# Altium schematic sheet Sheet1.SchDoc
size A4; SheetNumber: 1; SheetTotal: 6
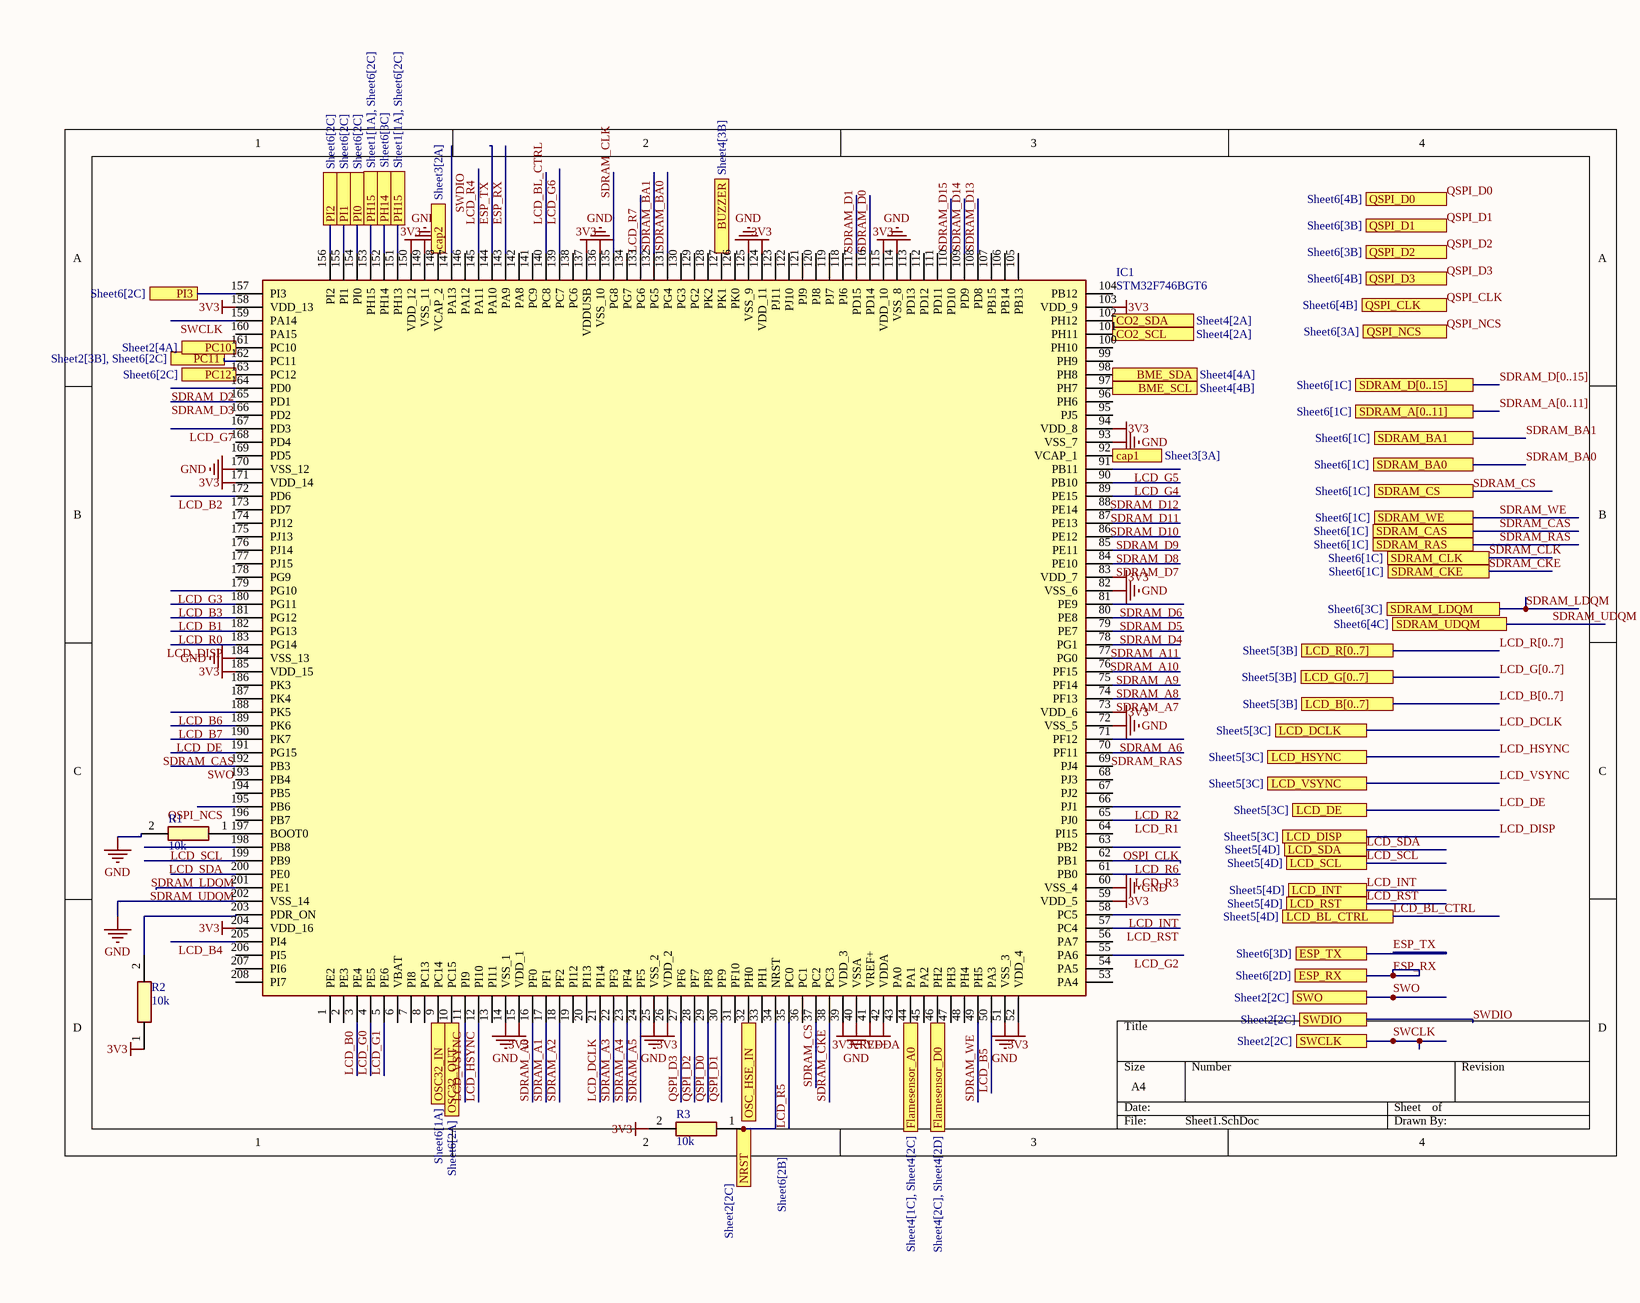
[diagram p0: Sheet1.SchDoc]

## Parts
IC1  STM32F746BGT6  [QFP50P3000X3000X160-208N]
R1  10k  [RESC1608X55N]
R2  10k  [RESC1608X55N]
R3  10k  [RESC1608X55N]

## Ports
BME_SCL (see Sheet4[4B]), BME_SDA (see Sheet4[4A]), BUZZER (see Sheet4[3B]), cap1 (see Sheet3[3A]), cap2 (see Sheet3[2A]), CO2_SCL (see Sheet4[2A]), CO2_SDA (see Sheet4[2A]), ESP_RX (see Sheet6[2D]), ESP_TX (see Sheet6[3D]), Flamesensor_A0 (see Sheet4[1C], Sheet4[2C]), Flamesensor_D0 (see Sheet4[2C], Sheet4[2D]), LCD_B[0..7] (see Sheet5[3B]), LCD_BL_CTRL (see Sheet5[4D]), LCD_DCLK (see Sheet5[3C]), LCD_DE (see Sheet5[3C]), LCD_DISP (see Sheet5[3C]), LCD_G[0..7] (see Sheet5[3B]), LCD_HSYNC (see Sheet5[3C]), LCD_INT (see Sheet5[4D]), LCD_R[0..7] (see Sheet5[3B]), LCD_RST (see Sheet5[4D]), LCD_SCL (see Sheet5[4D]), LCD_SDA (see Sheet5[4D]), LCD_VSYNC (see Sheet5[3C]), NRST (see Sheet2[2C]), OSC32_IN (see Sheet6[1A]), OSC32_OUT (see Sheet6[2A]), OSC_HSE_IN (see Sheet6[2B]), PC10 (see Sheet2[4A]), PC11 (see Sheet2[3B], Sheet6[2C]), PC12 (see Sheet6[2C]), PH14 (see Sheet6[3C]), PH15 (see Sheet1[1A], Sheet6[2C]), PI0 (see Sheet6[2C]), PI1 (see Sheet6[2C]), PI2 (see Sheet6[2C]), PI3 (see Sheet6[2C]), QSPI_CLK (see Sheet6[4B]), QSPI_D0 (see Sheet6[4B]), QSPI_D1 (see Sheet6[3B]), QSPI_D2 (see Sheet6[3B]), QSPI_D3 (see Sheet6[4B]), QSPI_NCS (see Sheet6[3A]), SDRAM_A[0..11] (see Sheet6[1C]), SDRAM_BA0 (see Sheet6[1C]), SDRAM_BA1 (see Sheet6[1C]), SDRAM_CAS (see Sheet6[1C]), SDRAM_CKE (see Sheet6[1C]), SDRAM_CLK (see Sheet6[1C]), SDRAM_CS (see Sheet6[1C]), SDRAM_D[0..15] (see Sheet6[1C]), SDRAM_LDQM (see Sheet6[3C]), SDRAM_RAS (see Sheet6[1C]), SDRAM_UDQM (see Sheet6[4C]), SDRAM_WE (see Sheet6[1C]), SWCLK (see Sheet2[2C]), SWDIO (see Sheet2[2C]), SWO (see Sheet2[2C])

## Nets
3V3: IC1.15(VDD_1) IC1.26(VDD_2) IC1.39(VDD_3) IC1.52(VDD_4) IC1.59(VDD_5) IC1.73(VDD_6) IC1.83(VDD_7) IC1.94(VDD_8) IC1.103(VDD_9) IC1.115(VDD_10) IC1.124(VDD_11) IC1.137(VDDUSB) IC1.150(VDD_12) IC1.158(VDD_13) IC1.171(VDD_14) IC1.185(VDD_15) IC1.204(VDD_16) R2.1 R3.2
GND: IC1.14(VSS_1) IC1.25(VSS_2) IC1.40(VSSA) IC1.51(VSS_3) IC1.60(VSS_4) IC1.72(VSS_5) IC1.82(VSS_6) IC1.93(VSS_7) IC1.114(VSS_8) IC1.125(VSS_9) IC1.136(VSS_10) IC1.149(VSS_11) IC1.170(VSS_12) IC1.184(VSS_13) IC1.202(VSS_14) R1.2
VDDA: IC1.42(VDDA)
VREF+: IC1.41(VREF+)
BME_SCL: IC1.97(PH7) ; port BME_SCL
BME_SDA: IC1.98(PH8) ; port BME_SDA
BUZZER: IC1.127(PK1) ; port BUZZER
cap1: IC1.92(VCAP_1) ; port cap1
cap2: IC1.148(VCAP_2) ; port cap2
CO2_SCL: IC1.101(PH11) ; port CO2_SCL
CO2_SDA: IC1.102(PH12) ; port CO2_SDA
ESP_RX: IC1.143(PA9) ; port ESP_RX
ESP_TX: IC1.144(PA10) ; port ESP_TX
Flamesensor_A0: IC1.44(PA1) ; port Flamesensor_A0
Flamesensor_D0: IC1.46(PH2) ; port Flamesensor_D0
LCD_B0: IC1.3(PE4)
LCD_B1: IC1.181(PG12)
LCD_B2: IC1.172(PD6)
LCD_B3: IC1.180(PG11)
LCD_B4: IC1.205(PI4)
LCD_B5: IC1.50(PA3)
LCD_B6: IC1.188(PK5)
LCD_B7: IC1.189(PK6)
LCD_BL_CTRL: IC1.140(PC8) ; port LCD_BL_CTRL
LCD_DCLK: IC1.21(PI14) ; port LCD_DCLK
LCD_DE: IC1.190(PK7) ; port LCD_DE
LCD_DISP: IC1.183(PG14) ; port LCD_DISP
LCD_G0: IC1.4(PE5)
LCD_G1: IC1.5(PE6)
LCD_G2: IC1.55(PA6)
LCD_G3: IC1.179(PG10)
LCD_G4: IC1.90(PB10)
LCD_G5: IC1.91(PB11)
LCD_G6: IC1.139(PC7)
LCD_G7: IC1.167(PD3)
LCD_HSYNC: IC1.12(PI10) ; port LCD_HSYNC
LCD_INT: IC1.58(PC5) ; port LCD_INT
LCD_R0: IC1.182(PG13)
LCD_R1: IC1.65(PJ0)
LCD_R2: IC1.66(PJ1)
LCD_R3: IC1.61(PB0)
LCD_R4: IC1.145(PA11)
LCD_R5: IC1.35(PC0)
LCD_R6: IC1.62(PB1)
LCD_R7: IC1.133(PG6)
LCD_RST: IC1.57(PC4) ; port LCD_RST
LCD_SCL: IC1.198(PB8) ; port LCD_SCL
LCD_SDA: IC1.199(PB9) ; port LCD_SDA
LCD_VSYNC: IC1.11(PI9) ; port LCD_VSYNC
NRST: IC1.34(NRST) R3.1 ; port NRST
OSC32_IN: IC1.9(PC14) ; port OSC32_IN
OSC32_OUT: IC1.10(PC15) ; port OSC32_OUT
OSC_HSE_IN: IC1.32(PH0) ; port OSC_HSE_IN
PC10: IC1.161(PC10) ; port PC10
PC11: IC1.162(PC11) ; port PC11
PC12: IC1.163(PC12) ; port PC12
PH14: IC1.152(PH14) ; port PH14
PH15: IC1.151(PH13) IC1.153(PH15) ; port PH15
PI0: IC1.154(PI0) ; port PI0
PI1: IC1.155(PI1) ; port PI1
PI2: IC1.156(PI2) ; port PI2
PI3: IC1.157(PI3) ; port PI3
QSPI_CLK: IC1.63(PB2) ; port QSPI_CLK
QSPI_D0: IC1.29(PF8) ; port QSPI_D0
QSPI_D1: IC1.30(PF9) ; port QSPI_D1
QSPI_D2: IC1.28(PF7) ; port QSPI_D2
QSPI_D3: IC1.27(PF6) ; port QSPI_D3
QSPI_NCS: IC1.195(PB6) ; port QSPI_NCS
SDRAM_A0: IC1.16(PF0)
SDRAM_A1: IC1.17(PF1)
SDRAM_A2: IC1.18(PF2)
SDRAM_A3: IC1.22(PF3)
SDRAM_A4: IC1.23(PF4)
SDRAM_A5: IC1.24(PF5)
SDRAM_A6: IC1.71(PF12)
SDRAM_A7: IC1.74(PF13)
SDRAM_A8: IC1.75(PF14)
SDRAM_A9: IC1.76(PF15)
SDRAM_A10: IC1.77(PG0)
SDRAM_A11: IC1.78(PG1)
SDRAM_BA0: IC1.131(PG4) ; port SDRAM_BA0
SDRAM_BA1: IC1.132(PG5) ; port SDRAM_BA1
SDRAM_CAS: IC1.191(PG15) ; port SDRAM_CAS
SDRAM_CKE: IC1.38(PC3) ; port SDRAM_CKE
SDRAM_CLK: IC1.135(PG8) ; port SDRAM_CLK
SDRAM_CS: IC1.37(PC2) ; port SDRAM_CS
SDRAM_D0: IC1.116(PD14)
SDRAM_D1: IC1.117(PD15)
SDRAM_D2: IC1.164(PD0)
SDRAM_D3: IC1.165(PD1)
SDRAM_D4: IC1.79(PE7)
SDRAM_D5: IC1.80(PE8)
SDRAM_D6: IC1.81(PE9)
SDRAM_D7: IC1.84(PE10)
SDRAM_D8: IC1.85(PE11)
SDRAM_D9: IC1.86(PE12)
SDRAM_D10: IC1.87(PE13)
SDRAM_D11: IC1.88(PE14)
SDRAM_D12: IC1.89(PE15)
SDRAM_D13: IC1.108(PD8)
SDRAM_D14: IC1.109(PD9)
SDRAM_D15: IC1.110(PD10)
SDRAM_LDQM: IC1.200(PE0) ; port SDRAM_LDQM
SDRAM_RAS: IC1.70(PF11) ; port SDRAM_RAS
SDRAM_UDQM: IC1.201(PE1) ; port SDRAM_UDQM
SDRAM_WE: IC1.49(PH5) ; port SDRAM_WE
SWCLK: IC1.159(PA14) ; port SWCLK
SWDIO: IC1.147(PA13) ; port SWDIO
SWO: IC1.192(PB3) ; port SWO
NetIC1_197: IC1.197(BOOT0) R1.1
NetIC1_203: IC1.203(PDR_ON) R2.2

Not connected (* = marked no-connect by the designer): IC1 1(PE2) 2(PE3) 6(VBAT) 7(PI8) 8(PC13) 13(PI11) 19(PI12) 20(PI13) 31(PF10) 33(PH1) 36(PC1) 43(PA0) 45(PA2) 47(PH3) 48(PH4) 53(PA4) 54(PA5) 56(PA7) 64(PI15) 67(PJ2) 68(PJ3) 69(PJ4) 95(PJ5) 96(PH6) 99(PH9) 100(PH10) 104(PB12) 105(PB13) 106(PB14) 107(PB15) 111(PD11) 112(PD12) 113(PD13) 118(PJ6) 119(PJ7) 120(PJ8) 121(PJ9) 122(PJ10) 123(PJ11) 126(PK0) 128(PK2) 129(PG2) 130(PG3) 134(PG7) 138(PC6) 141(PC9) 142(PA8) 146(PA12) 160(PA15) 166(PD2) 168(PD4) 169(PD5) 173(PD7) 174(PJ12) 175(PJ13) 176(PJ14) 177(PJ15) 178(PG9) 186(PK3) 187(PK4) 193(PB4) 194(PB5) 196(PB7) 206(PI5) 207(PI6) 208(PI7)

## Buses and harness runs
bus LCD_B[0..7] = port LCD_B[0..7]
bus LCD_G[0..7] = port LCD_G[0..7]
bus LCD_R[0..7] = port LCD_R[0..7]
bus SDRAM_A[0..11] = port SDRAM_A[0..11]
bus SDRAM_D[0..15] = port SDRAM_D[0..15]

## Library data of the parts
IC1 = STM32F746BGT6: Integrated Circuit; Manufacturer_Name: STMicroelectronics; Datasheet Link: https://www.st.com/resource/en/datasheet/stm32f746bg.pdf; Height: 1.6mm; Manufacturer_Part_Number: STM32F746BGT6; Mouser Part Number: 511-STM32F746BGT6; Mouser Price/Stock: https://www.mouser.co.uk/ProductDetail/STMicroelectronics/STM32F746BGT6?qs=E2FFEhwHWtcSD54rSf3kgw%3D%3D; Arrow Part Number: STM32F746BGT6; Arrow Price/Stock: https://www.arrow.com/en/products/stm32f746bgt6/stmicroelectronics?utm_currency=USD&region=nac
R1-R3 = RC0603FR-071KL: Resistor; Manufacturer_Name: YAGEO; Datasheet Link: https://www.yageo.com/upload/media/product/productsearch/datasheet/rchip/PYu-RC_Group_51_RoHS_L_12.pdf; Height: 0.55mm; Manufacturer_Part_Number: RC0603FR-071KL; Mouser Part Number: 603-RC0603FR-071KL; Mouser Price/Stock: https://www.mouser.co.uk/ProductDetail/YAGEO/RC0603FR-071KL?qs=VU8sRB4EgwApHsk4rF%2F3zg%3D%3D; Arrow Part Number: RC0603FR-071KL; Arrow Price/Stock: https://www.arrow.com/en/products/rc0603fr-071kl/yageo?utm_currency=USD&region=nac